# Altium project USB-RIAA.PrjPcb
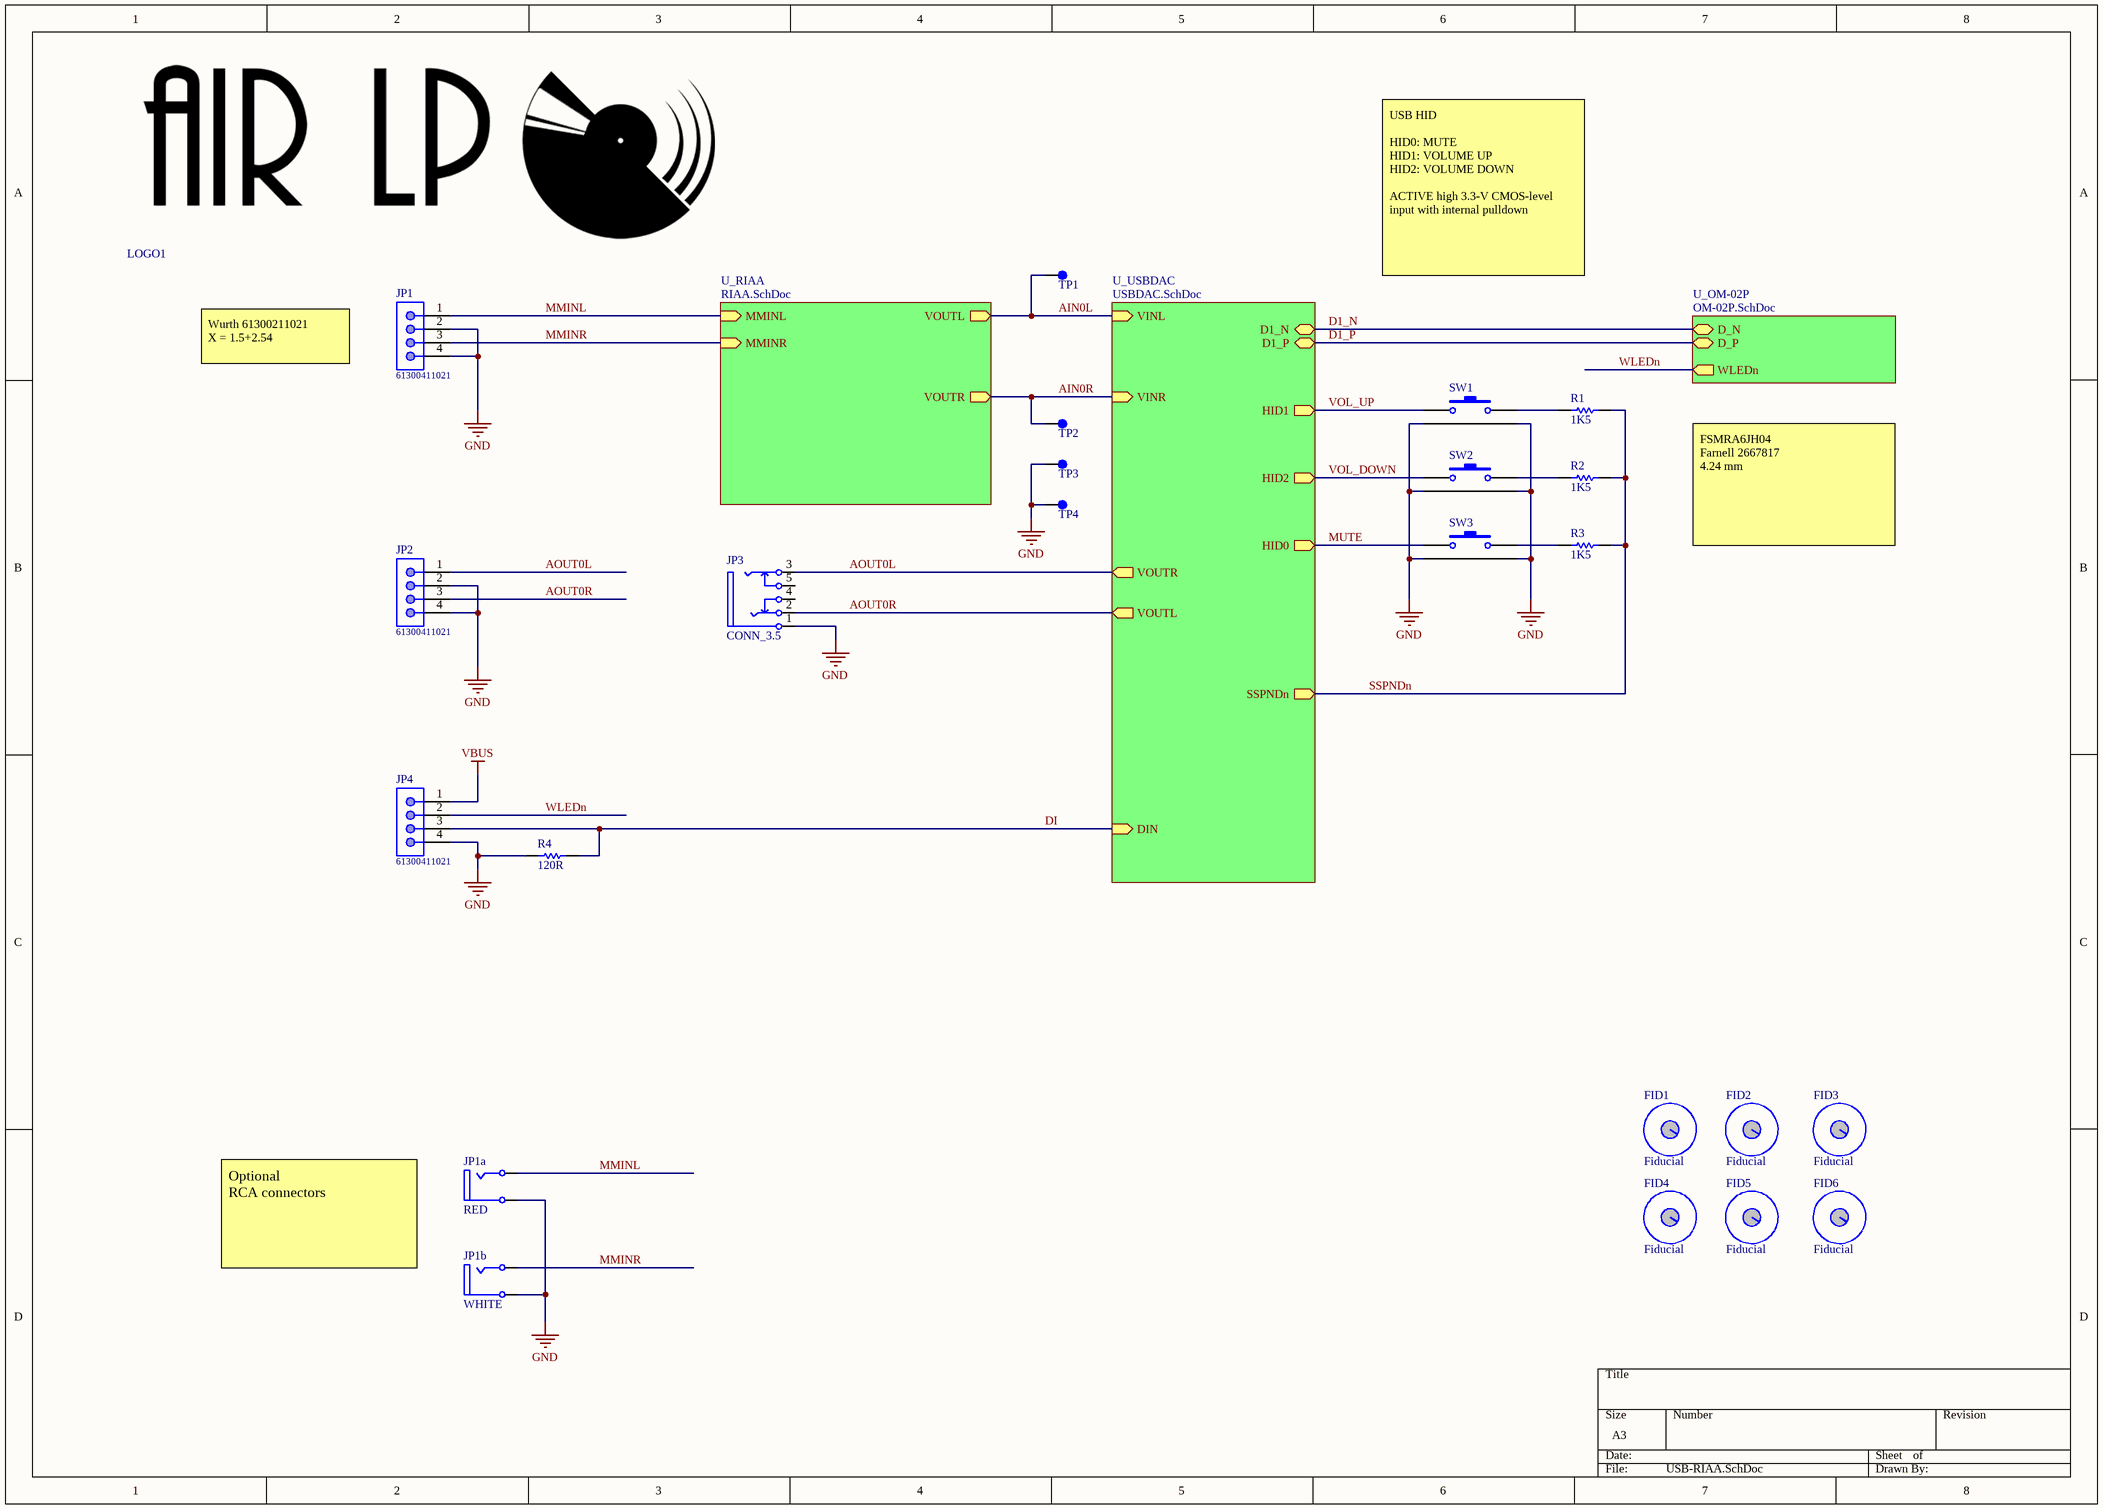
[diagram p0: USB-RIAA.SchDoc]
5 sheets, 135 parts. Net scope: hierarchical (ports join the sheet entries above them; power ports are global).
Board file: USB-RIAA.PcbDoc
Sheets:
  USB-RIAA.SchDoc
    U_RIAA = RIAA.SchDoc
    U_USBDAC = USBDAC.SchDoc
    U_OM-02P = OM-02P.SchDoc
  OM-O2P-ETH.SchDoc

## Sheet USB-RIAA.SchDoc
size A3

### Parts
FID1  Fiducial  [MECH_FID_PLUS]  (no BOM)
FID2  Fiducial  [MECH_FID_PLUS]  (no BOM)
FID3  Fiducial  [MECH_FID_PLUS]  (no BOM)
FID4  Fiducial  [MECH_FID_PLUS]  (no BOM)
FID5  Fiducial  [MECH_FID_PLUS]  (no BOM)
FID6  Fiducial  [MECH_FID_PLUS]  (no BOM)
JP1  61300411021  [61300411021]
JP1a  value RED  [CONN_RCA-Lumberg-Red-No3D]  (hidden comment: RCA RED)
JP1b  value WHITE  [CONN_RCA-Lumberg-White-No3D]  (hidden comment: RCA WHITE)
JP2  61300411021  [61300411021]
JP3  CONN_3.5  [CONN-3.5_LUMBERG_1503_09]
JP4  61300411021  [61300411021]
LOGO1  LOGO-AIRLP  [LOGO-AIR-LP]  (value not drawn)
R1  value 1K5  [RESC0805(2012)_N]  (hidden comment: RES)
R2  value 1K5  [RESC0805(2012)_N]  (hidden comment: RES)
R3  value 1K5  [RESC0805(2012)_N]  (hidden comment: RES)
R4  value 120R  [RESC0805(2012)_N]  (hidden comment: 120R 5% 0805(2012))
SW1  SW_TACT_FSMRA2JH  [SW_FSMRA2JH]  (value not drawn)
SW2  SW_TACT_FSMRA2JH  [SW_FSMRA2JH]  (value not drawn)
SW3  SW_TACT_FSMRA2JH  [SW_FSMRA2JH]  (value not drawn)
TP1  MECH_Testpoint  [MECH_TP_39_mil]  (value not drawn)
TP2  MECH_Testpoint  [MECH_TP_39_mil]  (value not drawn)
TP3  MECH_Testpoint  [MECH_TP_39_mil]  (value not drawn)
TP4  MECH_Testpoint  [MECH_TP_39_mil]  (value not drawn)

### Sub-sheets
U_OM-02P = OM-02P.SchDoc: D_P (bidir), D_N (bidir), WLEDn (out)
U_RIAA = RIAA.SchDoc: MMINL (in), MMINR (in), VOUTL (out), VOUTR (out)
U_USBDAC = USBDAC.SchDoc: VINL (in), VINR (in), VOUTL (out), VOUTR (out), SSPNDn (out), D1_P (bidir), D1_N (bidir), HID0 (out), HID1 (out), HID2 (out), DIN (in)

### Nets
GND: JP1.2 JP1.4 JP1a.1(Ground) JP1b.1(Ground) JP2.2 JP2.4 JP3.1(S) JP4.4 R4.1 SW1.3 SW1.4 SW2.3 SW2.4 SW3.3 SW3.4 TP3.1(Pin1) TP4.1(Pin1)
VBUS: JP4.1
AIN0L: TP1.1(Pin1) ; sheet U_RIAA/VOUTL, sheet U_USBDAC/VINL
AIN0R: TP2.1(Pin1) ; sheet U_RIAA/VOUTR, sheet U_USBDAC/VINR
AOUT0L: JP2.1 JP3.3(RN) ; sheet U_USBDAC/VOUTR
AOUT0R: JP2.3 JP3.2(T) ; sheet U_USBDAC/VOUTL
D1_N: sheet U_USBDAC/D1_N, sheet U_OM-02P/D_N
D1_P: sheet U_USBDAC/D1_P, sheet U_OM-02P/D_P
DI: JP4.3 R4.2 ; sheet U_USBDAC/DIN
MMINL: JP1.1 JP1a.4(Signal) ; sheet U_RIAA/MMINL
MMINR: JP1.3 JP1b.4(Signal) ; sheet U_RIAA/MMINR
MUTE: SW3.1 ; sheet U_USBDAC/HID0
SSPNDn: R1.1 R2.1 R3.1 ; sheet U_USBDAC/SSPNDn
VOL_DOWN: SW2.1 ; sheet U_USBDAC/HID2
VOL_UP: SW1.1 ; sheet U_USBDAC/HID1
WLEDn: JP4.2 ; sheet U_OM-02P/WLEDn
NetR1_2: R1.2 SW1.2
NetR2_2: R2.2 SW2.2
NetR3_2: R3.2 SW3.2

Not connected (* = marked no-connect by the designer): JP3 4 5

### Notes on the sheet
- USB HID
  HID0:	MUTE
  HID1:	VOLUME UP
  HID2:	VOLUME DOWN
  ACTIVE high 3.3-V CMOS-level input with internal pulldown
- Wurth 61300211021
  X = 1.5+2.54
- FSMRA6JH04
  Farnell 2667817
  4.24 mm
- Optional
  RCA connectors

### Library data of the parts
FID1-FID6 = MECH_FIDUCIAL_PLUS
JP1 JP2 JP4 = 61300411021: THT Angled Pin Header WR-PHD, Pitch 2.54 mm, Single Row, 4 pins; Pin Number: 4; Pitch: 2.54 mm; Gender: Male; Rated Current: 3 A; Working Voltage: 250 VAC; Withstanding Voltage: 500 VAC; Contact Resistance: 20 mOhm; ComponentLink1Description: Manufacturer; ComponentLink1URL: http://www.we-online.de; ComponentLink2Description: Datasheet; ComponentLink2URL: https://katalog.we-online.de/em/datasheet/6130xx11021.pdf; Part Number: 61300411021; Published Date: August 2018; Publisher: Wurth Elektronik; Operating Temperature: -40 to 105 degC; Mounting Technology: THT; Packaging: Bag; Row Number: Single; Orientation: Angled
JP1a = CONN_RCA_LUMBERG_RED: RCA panel-mount socket red, 1553 02 rot, Lumberg Connect GmbH; ELFA: 300-68-374; MPN: 1553 02 rot
JP1b = CONN_RCA_LUMBERG_WHITE: RCA panel-mount socket white, 1553 02 weiss, Lumberg Connect GmbH; ELFA: 300-68-376; MPN: 1553 02 weiss; Farnell: 2472276
JP3 = CONN_3.5_1503_09: Jack Socket, 3.5mm, Thru-Hole, Horizontal, 3-Conductor with Tip open & Ring closed; MPN: 1503 09; ELFA: 300-68-357; Farnell: 1243244
LOGO1 = LOGO-AIRLP: LOGO AIR LP
R1-R3 = RES: Generic resistor
R4 = CMP-1013-00052-1: 120R 0.125W 5% 0805 (2012 Metric)  SMD; Case-Metric: 2012; Case-EIA: 0805; Tolerance: 5 %; Technology: SMT; Power: 0.125 W
SW1-SW3 = SW_TACT_FSMRA2JH: SWITCH TACTILE SPST-NO 0.05A 12V; ELFA: 35-665-57; DigiKey: 450-1662-ND; Farnell: 1555987; MPN: FSMRA2JH
TP1-TP4 = MECH_Testpoint: Testpoint

## Sheet RIAA.SchDoc
size A3
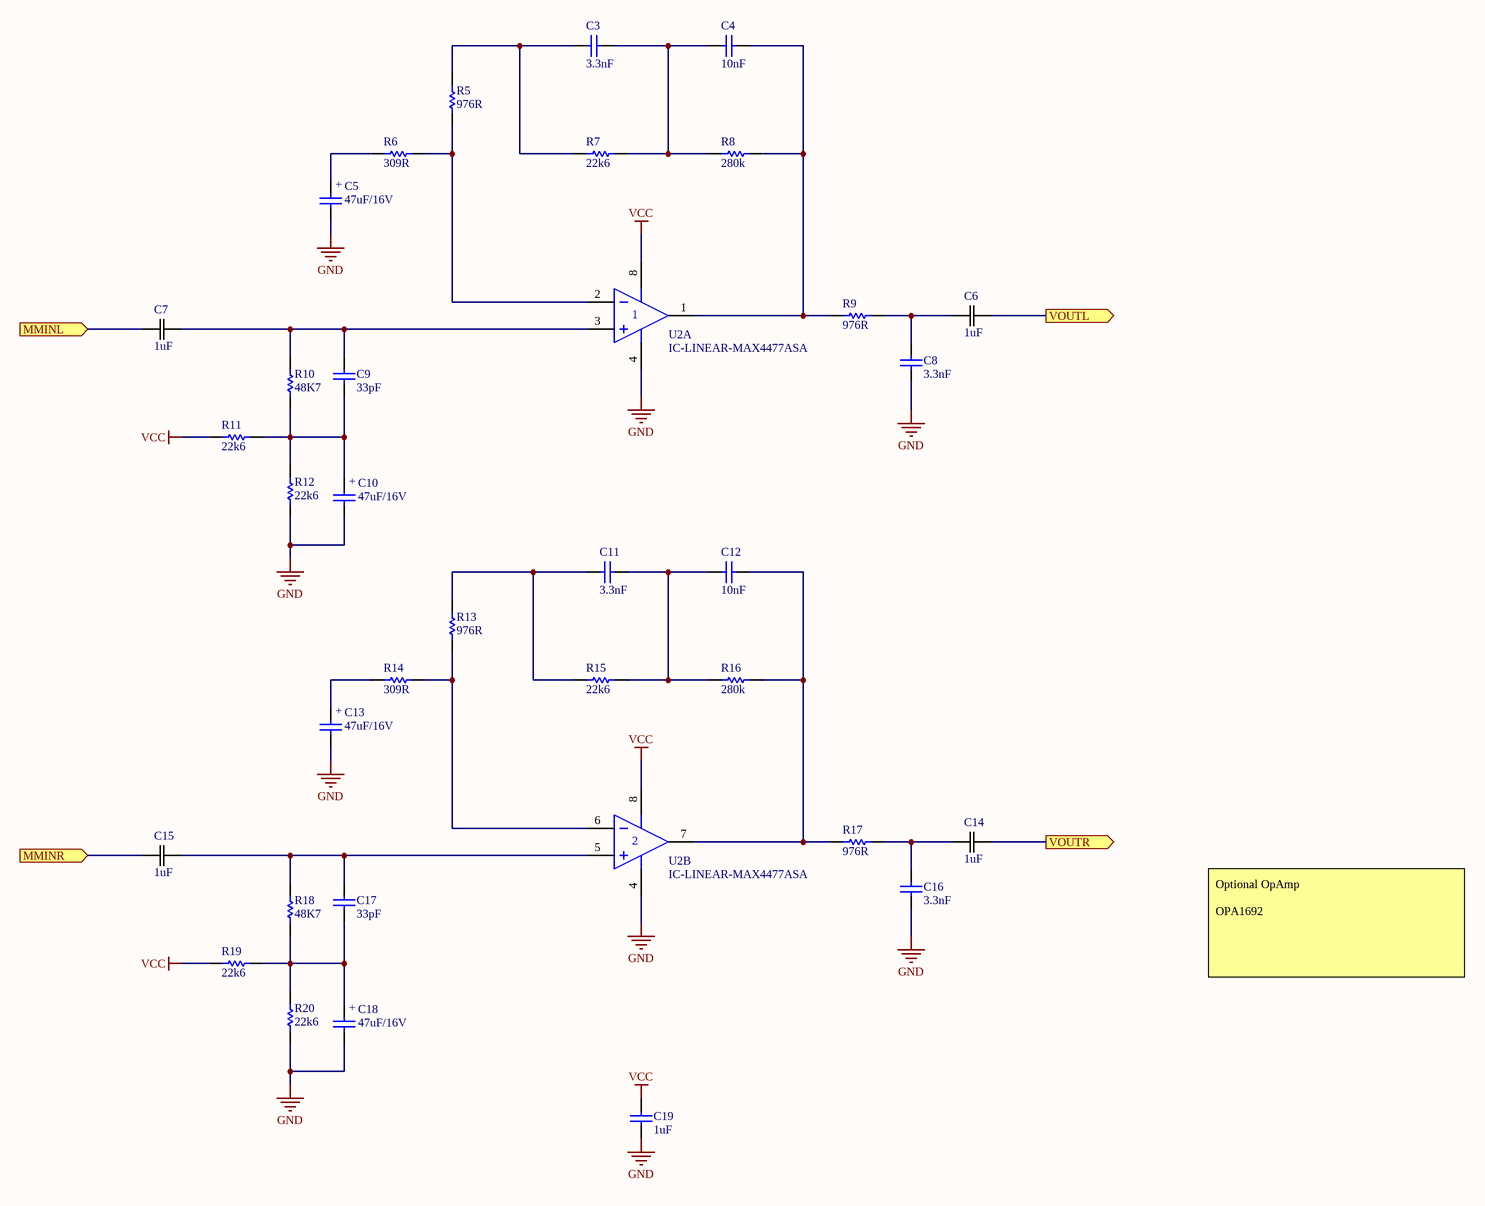
[diagram p1: RIAA.SchDoc]

### Parts
C3  value 3.3nF  [CAPC0805(2012)100_N]  (hidden comment: CAP 3.3nF 16V 0805(2012))
C4  value 10nF  [CAPC0805(2012)145_N]  (hidden comment: CAP 10nF 16V 0805(2012))
C5  47uF/16V  [CAPP_5x5.4]
C6  1uF  [CAP_ECPU_G2]
C7  1uF  [CAP_ECPU_G2]
C8  value 3.3nF  [CAPC0805(2012)100_N]  (hidden comment: CAP 3.3nF 16V 0805(2012))
C9  value 33pF  [CAPC0805(2012)100_N]  (hidden comment: CAP 33pF 16V 0805(2012))
C10  47uF/16V  [CAPP_5x5.4]
C11  value 3.3nF  [CAPC0805(2012)100_N]  (hidden comment: CAP 3.3nF 16V 0805(2012))
C12  value 10nF  [CAPC0805(2012)145_N]  (hidden comment: CAP 10nF 16V 0805(2012))
C13  47uF/16V  [CAPP_5x5.4]
C14  1uF  [CAP_ECPU_G2]
C15  1uF  [CAP_ECPU_G2]
C16  value 3.3nF  [CAPC0805(2012)100_N]  (hidden comment: CAP 3.3nF 16V 0805(2012))
C17  value 33pF  [CAPC0805(2012)100_N]  (hidden comment: CAP 33pF 16V 0805(2012))
C18  47uF/16V  [CAPP_5x5.4]
C19  value 1uF  [CAPC0805(2012)145_N]  (hidden comment: CAP 1uF 16V 0805(2012))
R5  value 976R  [RESC0805(2012)_N]  (hidden comment: 976R 1% 0805(2012))
R6  value 309R  [RESC0805(2012)_N]  (hidden comment: 309R 1% 0805(2012))
R7  value 22k6  [RESC0805(2012)_N]  (hidden comment: 22K6 1% 0805(2012))
R8  value 280k  [RESC0805(2012)_N]  (hidden comment: 280K 1% 0805(2012))
R9  value 976R  [RESC0805(2012)_N]  (hidden comment: 976R 1% 0805(2012))
R10  value 48K7  [RESC0805(2012)_N]  (hidden comment: 48K7 1% 0805(2012))
R11  value 22k6  [RESC0805(2012)_N]  (hidden comment: 22K6 1% 0805(2012))
R12  value 22k6  [RESC0805(2012)_N]  (hidden comment: 22K6 1% 0805(2012))
R13  value 976R  [RESC0805(2012)_N]  (hidden comment: 976R 1% 0805(2012))
R14  value 309R  [RESC0805(2012)_N]  (hidden comment: 309R 1% 0805(2012))
R15  value 22k6  [RESC0805(2012)_N]  (hidden comment: 22K6 1% 0805(2012))
R16  value 280k  [RESC0805(2012)_N]  (hidden comment: 280K 1% 0805(2012))
R17  value 976R  [RESC0805(2012)_N]  (hidden comment: 976R 1% 0805(2012))
R18  value 48K7  [RESC0805(2012)_N]  (hidden comment: 48K7 1% 0805(2012))
R19  value 22k6  [RESC0805(2012)_N]  (hidden comment: 22K6 1% 0805(2012))
R20  value 22k6  [RESC0805(2012)_N]  (hidden comment: 22K6 1% 0805(2012))
U2  IC-LINEAR-MAX4477ASA  [SOIC8_N]  (parts A,B of 2)

### Ports
MMINL (in), MMINR (in), VOUTL (out), VOUTR (out)

### Nets
GND: C5.2 C8.1 C10.2 C13.2 C16.1 C18.2 C19.1 R12.1 R20.1 U2.4(V-)
VCC: C19.2 R11.1 R19.1 U2.8(V+)
AIN0L: C6.2 ; port VOUTL
AIN0R: C14.2 ; port VOUTR
MMINL: C7.1 ; port MMINL
MMINR: C15.1 ; port MMINR
NetC3_1: C3.1 C4.1 R7.2 R8.1
NetC3_2: C3.2 R5.2 R7.1
NetC4_2: C4.2 R8.2 R9.2 U2.1(OUT1)
NetC5_1: C5.1 R6.1
NetC6_1: C6.1 C8.2 R9.1
NetC7_2: C7.2 C9.2 R10.1 U2.3(IN1+)
NetC9_1: C9.1 C10.1 R10.2 R11.2 R12.2
NetC11_1: C11.1 C12.1 R15.2 R16.1
NetC11_2: C11.2 R13.2 R15.1
NetC12_2: C12.2 R16.2 R17.2 U2.7(OUT2)
NetC13_1: C13.1 R14.1
NetC14_1: C14.1 C16.2 R17.1
NetC15_2: C15.2 C17.2 R18.1 U2.5(IN2+)
NetC17_1: C17.1 C18.1 R18.2 R19.2 R20.2
NetR5_1: R5.1 R6.2 U2.2(IN1-)
NetR13_1: R13.1 R14.2 U2.6(IN2-)

### Notes on the sheet
- Optional OpAmp
  OPA1692
- (in symbol CAPP_47UF16V_EEE-1CA470WR) +

### Library data of the parts
C3 C8 C11 C16 = CMP-1036-03397-1: CAP 3.3nF 16V ±1% 0805 (2012 Metric) Thickness 1mm SMD; Tolerance: Â±1%; Case-EIA: 0805; Case-Metric: 2012; Max Thickness: 1 mm; Rated Voltage: 16 V; Technology: SMT
C4 C12 = CMP-1036-03817-1: CAP 10nF 16V ±5% 0805 (2012 Metric) Thickness 1.45mm SMD; Case-EIA: 0805; Case-Metric: 2012; Tolerance: Â±5%; Technology: SMT; Rated Voltage: 16 V; Max Thickness: 1.45 mm
C5 C10 C13 C18 = CAPP_47UF16V_EEE-1CA470WR: 47µF 16V Aluminum Electrolytic Capacitors Radial, Can - SMD 1000 Hrs @ 85°C; Value: 47uF/16V; Farnell: 2753042; DigiKey: PCE3890TR-ND; MPN: EEE-1CA470WR
C6 C7 C14 C15 = CAP-ECP-U1C105MA5: 1µF Film Capacitor  16V Acrylic, Metallized - Stacked 1210 (3225 Metric); Vendor: Panasonic; Built_By: EMA_UL_Team; Type: DEV; C: Copyright (C) 2015 Accelerated Designs. All rights reserved; MPN: ECP-U1C105MA5; RefDes: RefDes; Value: 1uF
C9 C17 = CMP-1036-01404-1: CAP 33pF 16V ±1% 0805 (2012 Metric) Thickness 1mm SMD; Case-Metric: 2012; Case-EIA: 0805; Tolerance: Â±1%; Max Thickness: 1 mm; Technology: SMT; Rated Voltage: 16 V
C19 = CMP-1036-04748-1: CAP 1uF 16V ±20% 0805 (2012 Metric) Thickness 1.45mm SMD; Tolerance: Â±20%; Case-Metric: 2012; Case-EIA: 0805; Technology: SMT; Rated Voltage: 16 V; Max Thickness: 1.45 mm
R5 R9 R13 R17 = CMP-1013-00509-1: 976R 0.125W 1% 0805 (2012 Metric)  SMD; Case-EIA: 0805; Case-Metric: 2012; Power: 0.125 W; Technology: SMT; Tolerance: 1 %
R6 R14 = CMP-1013-00451-1: 309R 0.125W 1% 0805 (2012 Metric)  SMD; Case-EIA: 0805; Case-Metric: 2012; Technology: SMT; Tolerance: 1 %; Power: 0.125 W
R7 R11 R12 R15 R19 R20 = CMP-1013-00661-1: 22K6 0.125W 1% 0805 (2012 Metric)  SMD; Case-Metric: 2012; Case-EIA: 0805; Tolerance: 1 %; Technology: SMT; Power: 0.125 W
R8 R16 = CMP-1013-00785-1: 280K 0.125W 1% 0805 (2012 Metric)  SMD; Case-EIA: 0805; Case-Metric: 2012; Tolerance: 1 %; Power: 0.125 W; Technology: SMT
R10 R18 = CMP-1013-00701-1: 48K7 0.125W 1% 0805 (2012 Metric)  SMD; Case-Metric: 2012; Case-EIA: 0805; Tolerance: 1 %; Power: 0.125 W; Technology: SMT
U2 = IC-LINEAR-MAX4477ASA: Dual Rail-to-Rail output  Low-Power Operational Amplifier; MPN: MAX4477ASA+; Farnell: 1550527

## Sheet USBDAC.SchDoc
size A3
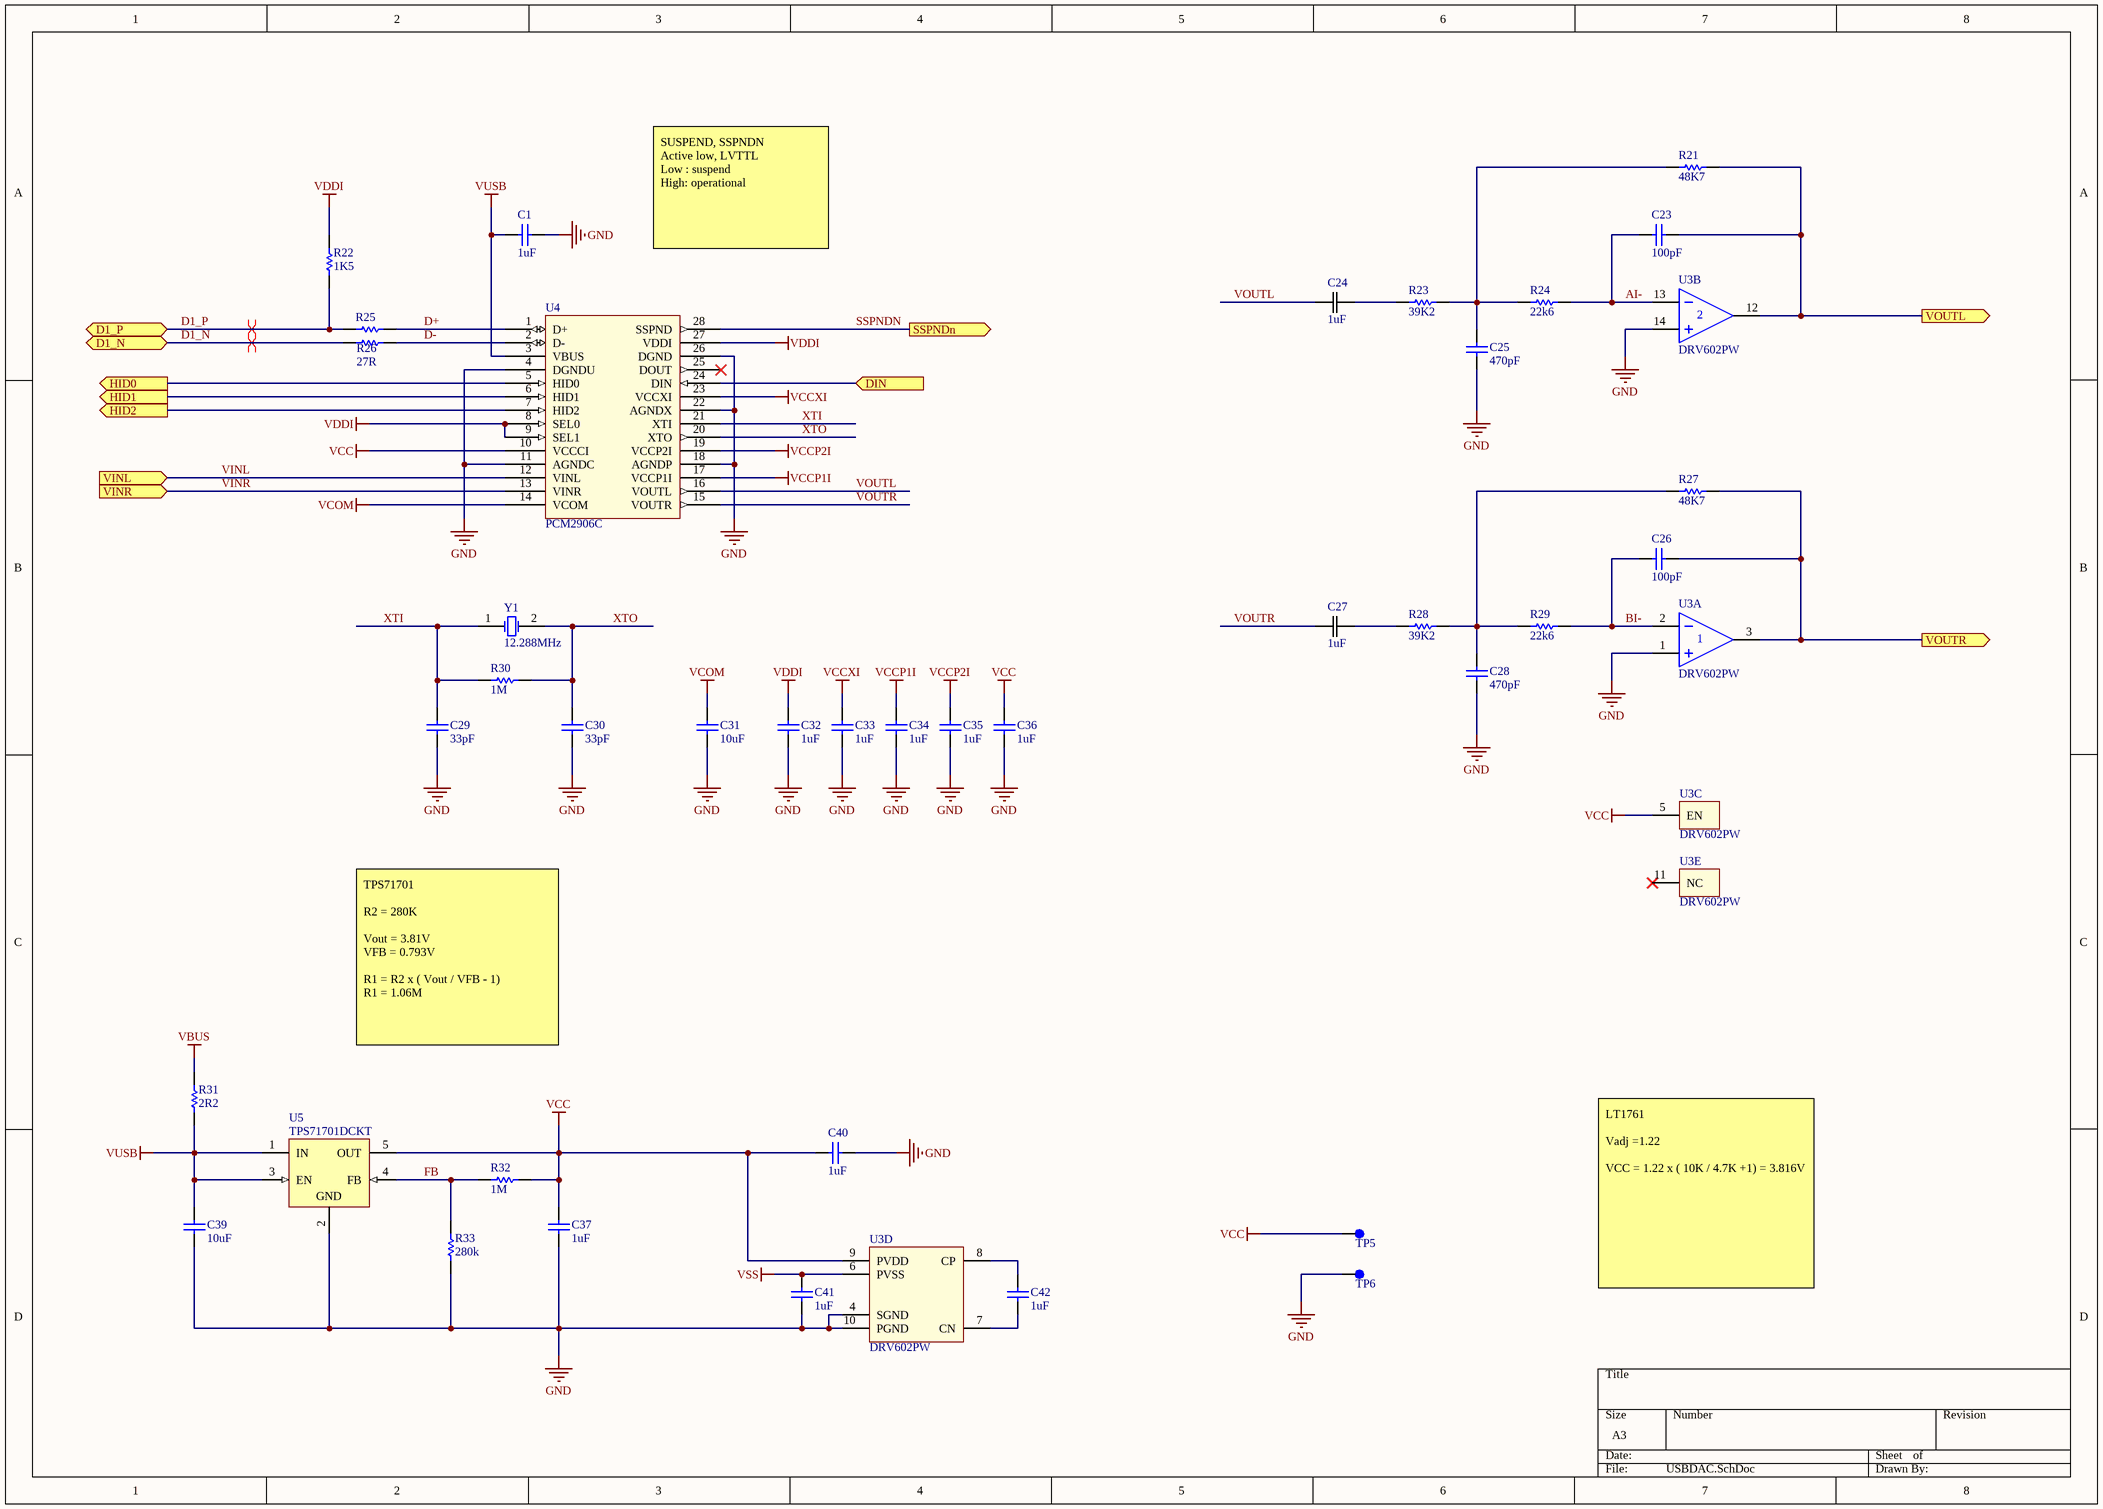
[diagram p2: USBDAC.SchDoc]

### Parts
C1  value 1uF  [CAPC0805(2012)145_N]  (hidden comment: CAP 1uF 16V 0805(2012))
C23  value 100pF  [CAPC0805(2012)75_N]  (hidden comment: CAP)
C24  1uF  [CAP_ECPU_G2]
C25  value 470pF  [CAPC0805(2012)75_N]  (hidden comment: CAP)
C26  value 100pF  [CAPC0805(2012)75_N]  (hidden comment: CAP)
C27  1uF  [CAP_ECPU_G2]
C28  value 470pF  [CAPC0805(2012)75_N]  (hidden comment: CAP)
C29  value 33pF  [CAPC0805(2012)100_N]  (hidden comment: CAP 33pF 16V 0805(2012))
C30  value 33pF  [CAPC0805(2012)100_N]  (hidden comment: CAP 33pF 16V 0805(2012))
C31  value 10uF  [CAPC0805(2012)145_N]  (hidden comment: CAP 10uF 16V 0805(2012))
C32  value 1uF  [CAPC0805(2012)145_N]  (hidden comment: CAP 1uF 16V 0805(2012))
C33  value 1uF  [CAPC0805(2012)145_N]  (hidden comment: CAP 1uF 16V 0805(2012))
C34  value 1uF  [CAPC0805(2012)145_N]  (hidden comment: CAP 1uF 16V 0805(2012))
C35  value 1uF  [CAPC0805(2012)145_N]  (hidden comment: CAP 1uF 16V 0805(2012))
C36  value 1uF  [CAPC0805(2012)145_N]  (hidden comment: CAP 1uF 16V 0805(2012))
C37  value 1uF  [CAPC0805(2012)145_N]  (hidden comment: CAP 1uF 16V 0805(2012))
C39  value 10uF  [CAPC0805(2012)145_N]  (hidden comment: CAP 10uF 16V 0805(2012))
C40  value 1uF  [CAPC0805(2012)145_N]  (hidden comment: CAP 1uF 16V 0805(2012))
C41  value 1uF  [CAPC0805(2012)145_N]  (hidden comment: CAP 1uF 16V 0805(2012))
C42  value 1uF  [CAPC0805(2012)145_L]  (hidden comment: CAP 1uF 16V 0805(2012))
R21  value 48K7  [RESC0805(2012)_N]  (hidden comment: 48K7 1% 0805(2012))
R22  value 1K5  [RESC0805(2012)_N]  (hidden comment: RES)
R23  value 39K2  [RESC0805(2012)_N]  (hidden comment: 39K2 1% 0805(2012))
R24  value 22k6  [RESC0805(2012)_N]  (hidden comment: 22K6 1% 0805(2012))
R25  RES  [RESC0402(1005)_L]  (value not drawn)
R26  value 27R  [RESC0402(1005)_L]  (hidden comment: RES)
R27  value 48K7  [RESC0805(2012)_N]  (hidden comment: 48K7 1% 0805(2012))
R28  value 39K2  [RESC0805(2012)_N]  (hidden comment: 39K2 1% 0805(2012))
R29  value 22k6  [RESC0805(2012)_N]  (hidden comment: 22K6 1% 0805(2012))
R30  value 1M  [RESC0603(1608)_N]  (hidden comment: RES)
R31  value 2R2  [RESC0805(2012)_N]  (hidden comment: 2R2 5% 0805(2012))
R32  value 1M  [RESC0805(2012)_L]  (hidden comment: 1M 1% 0805(2012))
R33  value 280k  [RESC0805(2012)_L]  (hidden comment: 280K 1% 0805(2012))
TP5  MECH_Testpoint  [MECH_TP_39_mil]  (value not drawn)
TP6  MECH_Testpoint  [MECH_TP_39_mil]  (value not drawn)
U3  DRV602PW  [TSSOP14_N]  (parts A,B,C,D,E of 5)
U4  PCM2906C  [SSOP28_N]
U5  TPS71701DCKT  [DCK0005A_L]
Y1  value 12.288MHz  [XTAL_SMD_5.0x3.2]  (hidden comment: ABM3-12.288MHZ-D2Y-T)

### Ports
D1_N (bidir), D1_P (bidir), DIN (in), HID0 (out), HID1 (out), HID2 (out), SSPNDn (out), VINL (in), VINR (in), VOUTL (out), VOUTR (out)

### Nets
GND: C1.1 C25.1 C28.1 C29.1 C30.1 C31.1 C32.1 C33.1 C34.1 C35.1 C36.1 C37.1 C39.1 C40.1 C41.1 R33.1 TP6.1(Pin1) U3.1(IN1+) U3.4(SGND) U3.10(PGND) U3.14(IN2+) U4.4(DGNDU) U4.11(AGNDC) U4.18(AGNDP) U4.22(AGNDX) U4.26(DGND) U5.2(GND)
VBUS: R31.2
VCC: C36.2 C37.2 C40.2 R32.2 TP5.1(Pin1) U3.5(EN) U3.9(PVDD) U4.10(VCCCI) U5.5(OUT)
VCCP1I: C34.2 U4.17(VCCP1I)
VCCP2I: C35.2 U4.19(VCCP2I)
VCCXI: C33.2 U4.23(VCCXI)
VCOM: C31.2 U4.14(VCOM)
VDDI: C32.2 R22.2 U4.8(SEL0) U4.9(SEL1) U4.27(VDDI)
VSS: C41.2 U3.6(PVSS)
VUSB: C1.2 C39.2 R31.1 U4.3(VBUS) U5.1(IN) U5.3(EN)
AI-: C23.2 R24.2 U3.13(IN2-)
AOUT0L: C26.1 R27.1 U3.3(OUT1) ; port VOUTR
AOUT0R: C23.1 R21.1 U3.12(OUT2) ; port VOUTL
BI-: C26.2 R29.2 U3.2(IN1-)
D1_N: R26.1 ; port D1_N
D1_P: R22.1 R25.1 ; port D1_P
D+: R25.2 U4.1(D+)
D-: R26.2 U4.2(D-)
DI: U4.24(DIN) ; port DIN
FB: R32.1 R33.2 U5.4(FB)
MUTE: U4.5(HID0) ; port HID0
SSPNDn: U4.28(SSPND) ; port SSPNDn
VINL: U4.12(VINL) ; port VINL  [project net AIN0L]
VINR: U4.13(VINR) ; port VINR  [project net AIN0R]
VOL_DOWN: U4.7(HID2) ; port HID2
VOL_UP: U4.6(HID1) ; port HID1
VOUTL: C24.1 U4.16(VOUTL)
VOUTR: C27.1 U4.15(VOUTR)
XTI: C29.2 R30.1 U4.21(XTI) Y1.1(OSC1)
XTO: C30.2 R30.2 U4.20(XTO) Y1.2(OSC2)
NetC24_2: C24.2 R23.2
NetC25_2: C25.2 R21.2 R23.1 R24.1
NetC27_2: C27.2 R28.2
NetC28_2: C28.2 R27.2 R28.1 R29.1
NetC42_1: C42.1 U3.7(CN)
NetC42_2: C42.2 U3.8(CP)

Not connected (* = marked no-connect by the designer): U3 11(NC)*; U4 25(DOUT)*

### Layout directives
differential pair: D1_N, D1_P

### Notes on the sheet
- SUSPEND, SSPNDN
  Active low, LVTTL
  Low : suspend
  High: operational
- TPS71701
  R2 = 280K
  Vout = 3.81V
  VFB = 0.793V
  R1 = R2 x ( Vout / VFB - 1)
  R1 = 1.06M
- LT1761
  Vadj =1.22
  VCC = 1.22 x ( 10K / 4.7K +1) = 3.816V

### Library data of the parts
C1 C32-C37 C40-C42 = CMP-1036-04748-1: as C19 on sheet RIAA; Technology: SMT; Rated Voltage: 16 V; Max Thickness: 1.45 mm
C23 C25 C26 C28 = CAP: Generic capacitor non polarised
C24 C27 = CAP-ECP-U1C105MA5: as C6 on sheet RIAA; MPN: ECP-U1C105MA5; RefDes: RefDes; Value: 1uF
C29 C30 = CMP-1036-01404-1: as C9 on sheet RIAA; Max Thickness: 1 mm; Technology: SMT; Rated Voltage: 16 V
C31 C39 = CMP-1036-04929-1: CAP 10uF 16V ±20% 0805 (2012 Metric) Thickness 1.45mm SMD; Tolerance: Â±20%; Case-EIA: 0805; Case-Metric: 2012; Rated Voltage: 16 V; Technology: SMT; Max Thickness: 1.45 mm
R21 R27 = CMP-1013-00701-1: as R10 on sheet RIAA; Tolerance: 1 %; Power: 0.125 W; Technology: SMT
R22 R26 R30 = RES: Generic resistor
R23 R28 = CMP-1013-00690-1: 39K2 0.125W 1% 0805 (2012 Metric)  SMD; Case-Metric: 2012; Case-EIA: 0805; Power: 0.125 W; Tolerance: 1 %; Technology: SMT
R24 R29 = CMP-1013-00661-1: as R7 on sheet RIAA; Tolerance: 1 %; Technology: SMT; Power: 0.125 W
R25 = RES: Generic resistor; Value: 27R
R31 = CMP-1013-00010-1: 2R2 0.125W 5% 0805 (2012 Metric)  SMD; Case-Metric: 2012; Case-EIA: 0805; Technology: SMT; Tolerance: 5 %; Power: 0.125 W
R32 = CMP-1013-00849-1: 1M 0.125W 1% 0805 (2012 Metric)  SMD; Case-Metric: 2012; Case-EIA: 0805; Technology: SMT; Power: 0.125 W; Tolerance: 1 %
R33 = CMP-1013-00785-1: as R8 on sheet RIAA; Tolerance: 1 %; Power: 0.125 W; Technology: SMT
TP5 TP6 = MECH_Testpoint: Testpoint
U3 = IC-LINEAR-DRV602PW: Amplifier IC 2-Channel (Stereo) Class AB 14-TSSOP; Farnell: 1710798; MPN: DRV602PW; DigiKey: 296-24081-1-ND
U4 = IC-AUDIO-PCM2906C: IC STEREO AUD CODEC W/USB 28SSOP
U5 = CMP-0394-00856-2: Single Output LDO, 150 mA, Adjustable 0.9 to 6.2 V Output, 2.5 to 6.5 V Input, with High-Bandwidth PSRR, 5-pin SC70 (DCK), -40 to 125 degC, Green (RoHS & no Sb/Br); Manufacturer: Texas Instruments; Vin(Max)(V): 6.5; Iq(Typ)(mA): 0.05; Vdo(Typ)(mV): 170; Vout Adj(Min)(V): 0.9; Accuracy(%): 3; Iout(Max)(A): 0.15; Vout Adj(Max)(V): 6.2; Vin(Min)(V): 2.5; SubFamily: Single Channel LDO; PackageVersion: 4093553-3/G; Code_JEDEC: MO-203; ComponentLink2Description: Datasheet; ComponentLink1URL: http://www.ti.com/; ComponentLink3Description: Package Specification; ComponentLink2URL: http://www.ti.com/general/docs/lit/getliterature.tsp?genericPartNumber=TPS71701&fileType=pdf; PartNumber: TPS71701DCKT; Eco-Plan: Green (RoHS & no Sb/Br); Mounting Technology: Surface Mount; ComponentLink1Description: Manufacturer URL; ComponentLink3URL: http://www.ti.com/litv/pdf/mpds025f; PackageDescription: 5-Pin Plastic Small-Outline, Body 2 x 1.25 mm, Pitch 0.65 mm; PackageReference: DCK0005A; DatasheetVersion: SBVS068G
Y1 = XTAL_12.288MHz_ABM3-12.288MHZ-D2Y-T: CRYSTAL 12.288MHZ 18PF SMD; Farnell: 1368769; MPN: ABM3-12.288MHZ-D2Y-T; DigiKey: 535-10635-1-ND

## Sheet OM-02P.SchDoc
size A3
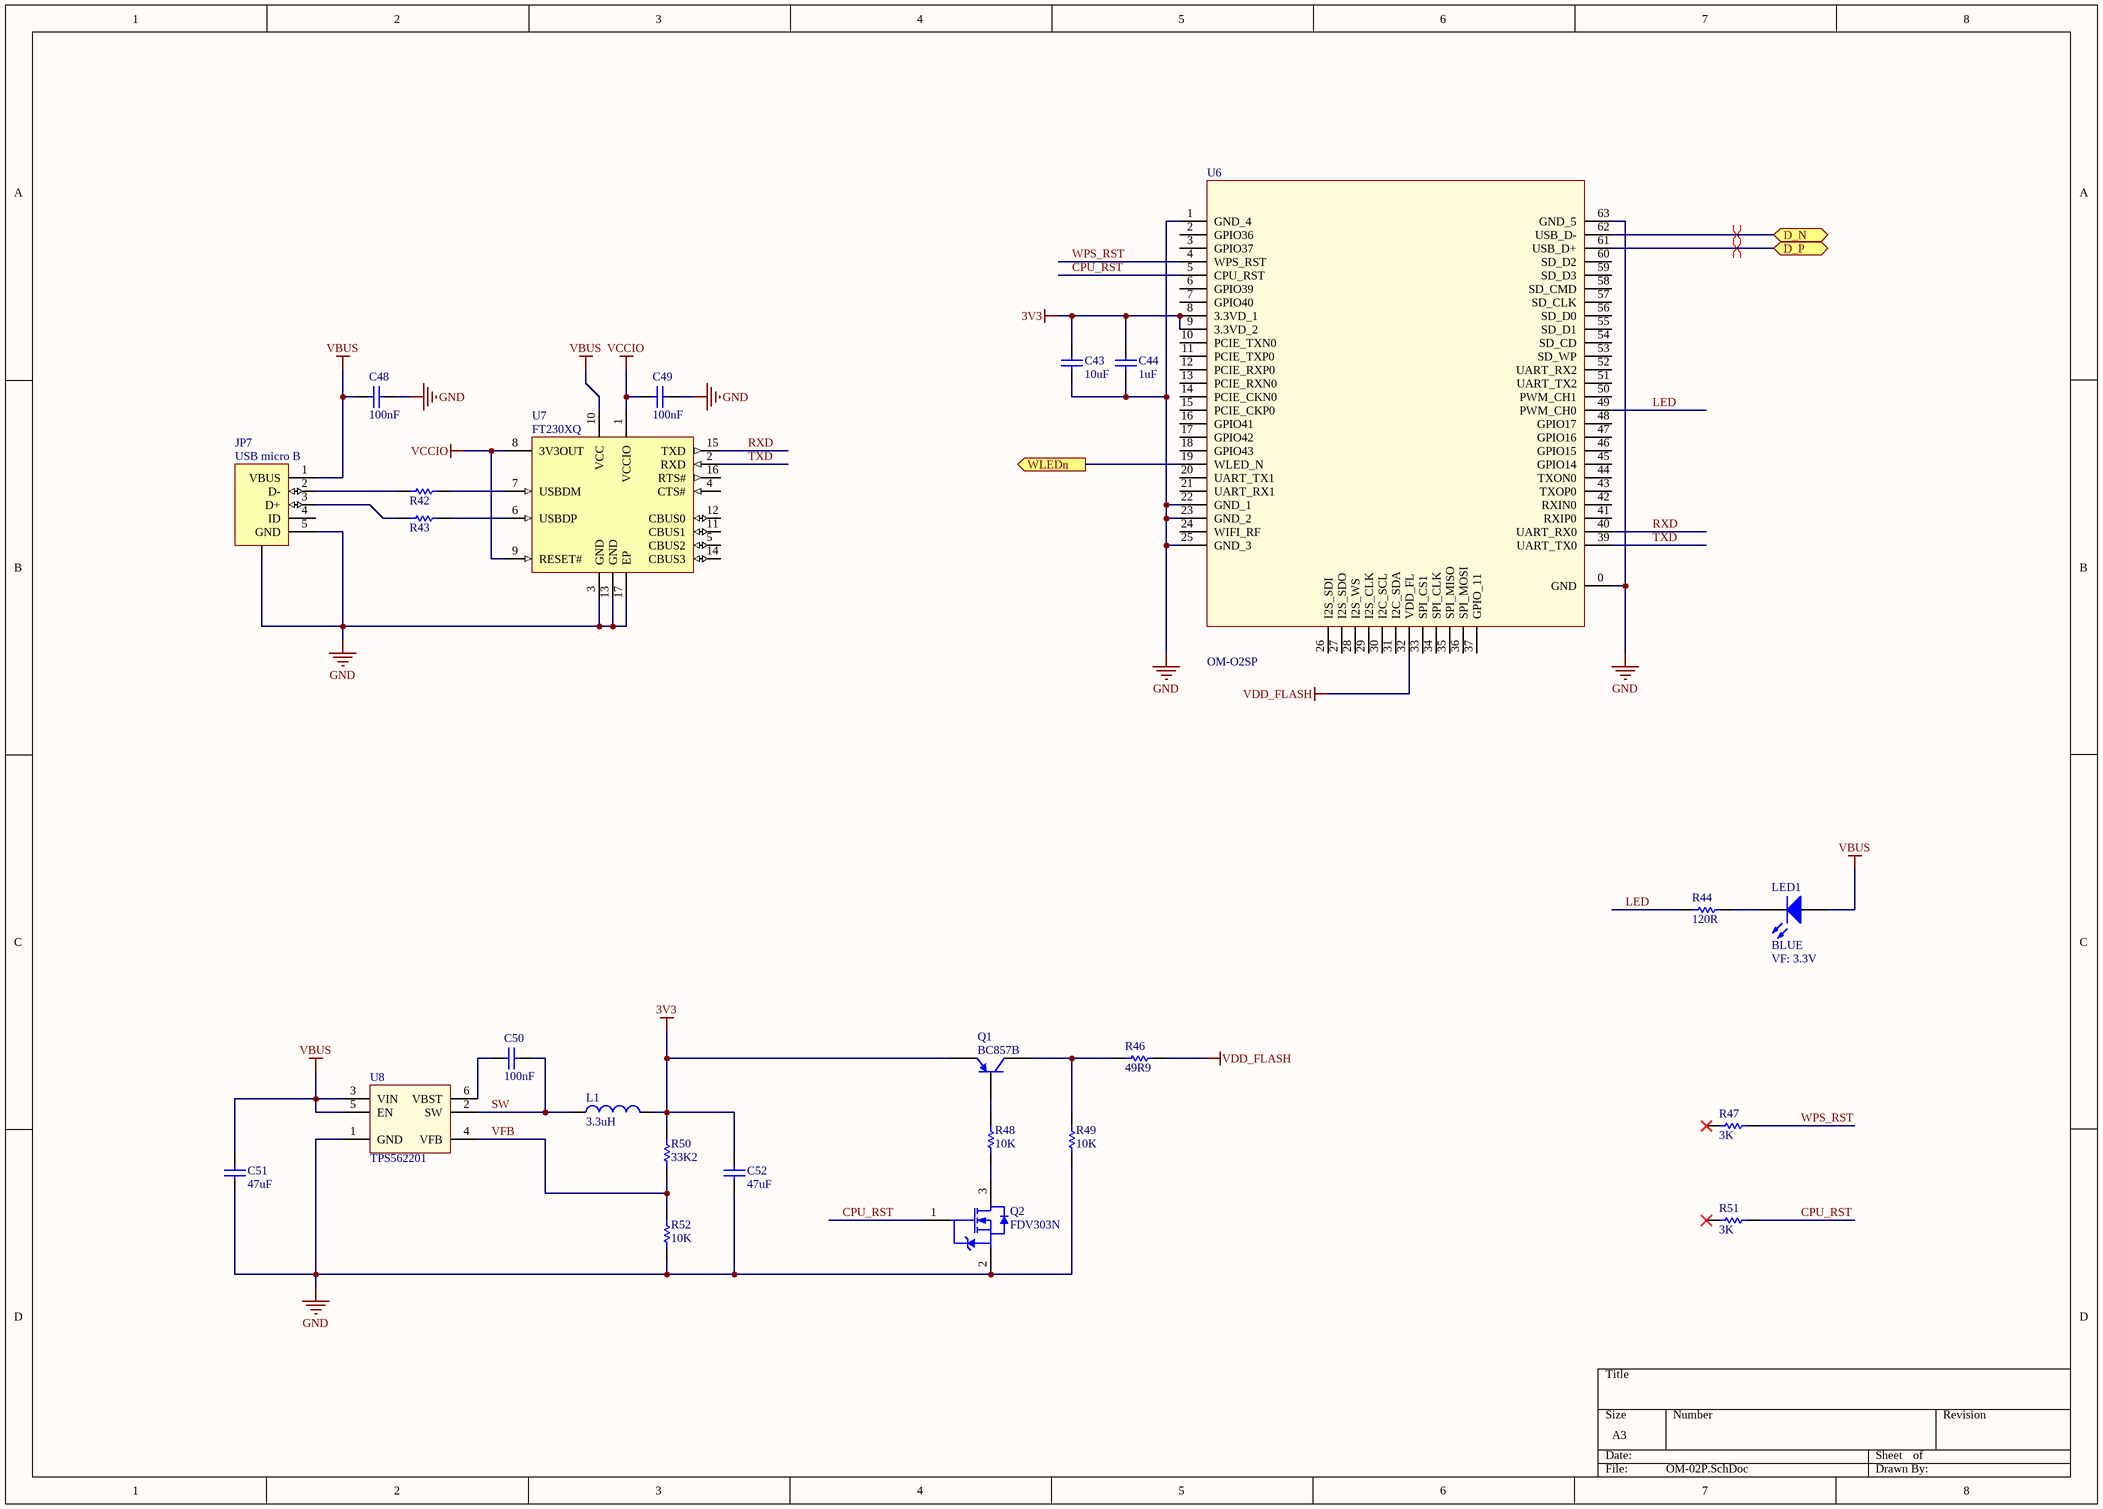
[diagram p3: OM-02P.SchDoc]

### Parts
C43  value 10uF  [CAPC0805(2012)145_N]  (hidden comment: CAP 10uF 16V 0805(2012))
C44  value 1uF  [CAPC0805(2012)145_N]  (hidden comment: CAP 1uF 16V 0805(2012))
C48  value 100nF  [CAPC0805(2012)100_M]  (hidden comment: CAP 100nF 16V 0805(2012))
C49  value 100nF  [CAPC0805(2012)100_M]  (hidden comment: CAP 100nF 16V 0805(2012))
C50  value 100nF  [CAPC0805(2012)100_N]  (hidden comment: CAP 100nF 16V 0805(2012))
C51  value 47uF  [CAPC1210(3225)280_N]  (hidden comment: CAP 47uF 16V 1210(3225))
C52  value 47uF  [CAPC1210(3225)280_N]  (hidden comment: CAP 47uF 16V 1210(3225))
JP7  USB micro B  [CONN_USB_MICRO_B_105017]
L1  value 3.3uH  [CAPC1008(2520)]  (hidden comment: MAMK2520T3R3M)
LED1  BLUE  VF: 3.3V  [LED-KA-4040QBS-D]
Q1  BC857B  [INF-SOT23_M]
Q2  FDV303N  [FAIR-FDV303N-3_V]
R42  RES  [RESC0402(1005)_L]  (value not drawn)
R43  RES  [RESC0402(1005)_L]  (value not drawn)
R44  value 120R  [RESC0805(2012)_N]  (hidden comment: 120R 5% 0805(2012))
R46  value 49R9  [RESC0805(2012)_N]  (hidden comment: 49R9 1% 0805(2012))
R47  value 3K  [RESC0805(2012)_M]  (hidden comment: 3K 5% 0805(2012))
R48  value 10K  [RESC0805(2012)_N]  (hidden comment: 10K 5% 0805(2012))
R49  value 10K  [RESC0805(2012)_N]  (hidden comment: 10K 5% 0805(2012))
R50  value 33K2  [RESC0805(2012)_N]  (hidden comment: 33K2 1% 0805(2012))
R51  value 3K  [RESC0805(2012)_M]  (hidden comment: 3K 5% 0805(2012))
R52  value 10K  [RESC0805(2012)_N]  (hidden comment: 10K 1% 0805(2012))
U6  OM-O2SP  [CPU-OM-O2S]
U7  FT230XQ  [QFN-16_N]
U8  TPS562201  [SOT23-6_L]

### Ports
D_N (bidir), D_P (bidir), WLEDn (out)

### Nets
3V3: C43.2 C44.2 C52.2 L1.2 Q1.2(E) R50.2 U6.8(3.3VD_1) U6.9(3.3VD_2)
GND: C43.1 C44.1 C48.1 C49.1 C51.1 C52.1 JP7.0(CHS) JP7.5(GND) Q2.2(S) R49.2 R52.1 U6.0(GND) U6.1(GND_4) U6.22(GND_1) U6.23(GND_2) U6.25(GND_3) U6.63(GND_5) U7.3(GND) U7.13(GND) U7.17(EP) U8.1(GND)
VBUS: C48.2 C51.2 JP7.1(VBUS) LED1.A U7.10(VCC) U8.3(VIN) U8.5(EN)
VCCIO: C49.2 U7.1(VCCIO) U7.8(3V3OUT) U7.9(RESET#)
VDD_FLASH: R46.2 U6.32(VDD_FL)
CPU_RST: Q2.1(G) R51.1 U6.5(CPU_RST)
D1_N: U6.62(USB_D-) ; port D_N
D1_P: U6.61(USB_D+) ; port D_P
LED: R44.2 U6.49(PWM_CH0)
RXD: U6.40(UART_RX0) U7.15(TXD)
SW: C50.1 L1.1 U8.2(SW)
TXD: U6.39(UART_TX0) U7.2(RXD)
VFB: R50.1 R52.2 U8.4(VFB)
WLEDn: U6.19(WLED_N) ; port WLEDn
WPS_RST: R47.1 U6.4(WPS_RST)
NetC50_2: C50.2 U8.6(VBST)
NetJP7_2: JP7.2(D-) R42.1
NetJP7_3: JP7.3(D+) R43.1
NetLED1_K: LED1.K R44.1
NetQ1_1: Q1.1(B) R48.1
NetQ1_3: Q1.3(C) R46.1 R49.1
NetQ2_3: Q2.3(D) R48.2
NetR42_2: R42.2 U7.7(USBDM)
NetR43_2: R43.2 U7.6(USBDP)

Not connected (* = marked no-connect by the designer): JP7 4(ID); R47 2*; R51 2*; U6 2(GPIO36) 3(GPIO37) 6(GPIO39) 7(GPIO40) 10(PCIE_TXN0) 11(PCIE_TXP0) 12(PCIE_RXP0) 13(PCIE_RXN0) 14(PCIE_CKN0) 15(PCIE_CKP0) 16(GPIO41) 17(GPIO42) 18(GPIO43) 20(UART_TX1) 21(UART_RX1) 24(WIFI_RF) 26(I2S_SDI) 27(I2S_SDO) 28(I2S_WS) 29(I2S_CLK) 30(I2C_SCL) 31(I2C_SDA) 33(SPI_CS1) 34(SPI_CLK) 35(SPI_MISO) 36(SPI_MOSI) 37(GPIO_11) 41(RXIP0) 42(RXIN0) 43(TXOP0) 44(TXON0) 45(GPIO14) 46(GPIO15) 47(GPIO16) 48(GPIO17) 50(PWM_CH1) 51(UART_TX2) 52(UART_RX2) 53(SD_WP) 54(SD_CD) 55(SD_D1) 56(SD_D0) 57(SD_CLK) 58(SD_CMD) 59(SD_D3) 60(SD_D2); U7 4(CTS#) 5(CBUS2) 11(CBUS1) 12(CBUS0) 14(CBUS3) 16(RTS#)

### Layout directives
differential pair: D1_N, D1_P

### Library data of the parts
C43 = CMP-1036-04929-1: as C31 on sheet USBDAC; Rated Voltage: 16 V; Technology: SMT; Max Thickness: 1.45 mm
C44 = CMP-1036-04748-1: as C19 on sheet RIAA; Technology: SMT; Rated Voltage: 16 V; Max Thickness: 1.45 mm
C48-C50 = CMP-1036-04400-1: CAP 100nF 16V ±5% 0805 (2012 Metric) Thickness 1mm SMD; Case-EIA: 0805; Tolerance: Â±5%; Case-Metric: 2012; Max Thickness: 1 mm; Technology: SMT; Rated Voltage: 16 V
C51 C52 = CMP-1038-02296-1: CAP 47uF 16V ±20% 1210 (3225 Metric) Thickness 2.8mm SMD; MPN: C1210C476M4PACTU; Case-EIA: 1210; Case-Metric: 3225; Tolerance: Â±20%; Technology: SMT; Max Thickness: 2.8 mm; Rated Voltage: 16 V
JP7 = CONN_USB_MICRO_B_105017: USB - micro B USB 2.0 Receptacle Connector 5 Position Surface Mount, Right Angle; MPN: 1050170001; Farnell: 2293836; DigiKey: WM1399TR-ND
L1 = L-MAMK2520T3R3M: 3.3µH Shielded Wirewound Inductor 1.7A 156 mOhm Max 1008 (2520 Metric); DigiKey: 587-3227-2-ND; MPN: MAMK2520T3R3M
LED1 = LED-BLUE-KA-4040QBS-D: LED 0805; VALUE: BLUE; MPN: KA-4040QBS-D; Farnell: 2079906
Q1 = CMP-1177-00036-1: PNP Silicon AF Transistor, 45 V VCEO, 100 mA IC, SOT23, Reel, Green; Manufacturer: Infineon; Ptot (max): 330Â mW; fT (typ): 250Â MHz; VCBO (max): 50Â V; ICM (max): 200Â mA; Green: TRUE; VCEO (max): 45Â V; VEBO (max): 5Â V; ICBO (max): 15Â nA; IC (max): 100Â mA; ComponentLink2Description: Datasheet; PartNumber: BC857B; PackageReference: SOT23; ComponentLink1URL: http://www.infineon.com/; IBM (max): 200Â mA; PackageDescription: 3-Pin Small Outline Transistor Package, 1.3 x 2.9 mm Body, 0.95 mm Pitch; ComponentLink3URL: http://www.infineon.com/dgdl/SOT23-Package_Overview.pdf?folderId=db3a30431936bc4b0119532290053c66&fileId=db3a30431936bc4b0119533468123c85; ComponentLink3Description: Package Specification; Mounting Technology: Surface Mount; ComponentLink1Description: Manufacturer URL; PackageVersion: Apr-08; Polarity: PNP; ComponentLink2URL: http://www.infineon.com/dgdl/bc857series_bc858series_bc859series_bc860series.pdf?folderId=db3a304314dca389011541d30fa21656&fileId=db3a304314dca389011541da0e3a1661; Packing: Reel
Q2 = CMP-2000-05111-1: N-Channel MOSFET Transistor, 8 V VGSS, 25 V VDSS, 0.68 A, -55 to 150 degC, 3-Pin SOT23, RoHS, Tape and Reel; Manufacturer: Fairchild; Typical Turn-On Delay Time: 3ns; Channel Mode: Enhancement; RDS-on: 450@4.5VmOhm; Maximum Continuous Drain Current: 0.68A; Maximum Drain Source Voltage: 25V; Rad Hard: No; Typical Fall Time: 13ns; Channel Type: N; Typical Turn-Off Delay Time: 17ns; Maximum Gate Source Voltage: 8V; Typical Rise Time: 8.5ns; Mounting: SurfaceMount; Packaging: Tape&Reel; Manufacturer URL: https://www.fairchildsemi.com/; Datasheet URL: https://datasheet.ciiva.com/22681/1845307-22681736.pdf; Package: 3SOT-23; Category: MOSFET; Operating Temperature: -55to150degC; Datasheet Version: Rev. D2, 07/2014
R42 R43 = RES: Generic resistor; Value: 27R
R44 = CMP-1013-00052-1: as R4 on sheet USB-RIAA; Tolerance: 5 %; Technology: SMT; Power: 0.125 W
R46 = CMP-1013-00363-1: 49R9 0.125W 1% 0805 (2012 Metric)  SMD; Case-Metric: 2012; Case-EIA: 0805; Power: 0.125 W; Tolerance: 1 %; Technology: SMT
R47 R51 = CMP-1013-00085-1: 3K 0.125W 5% 0805 (2012 Metric)  SMD; Case-Metric: 2012; Case-EIA: 0805; Power: 0.125 W; Tolerance: 5 %; Technology: SMT
R48 R49 = CMP-1013-00098-1: 10K 0.125W 5% 0805 (2012 Metric)  SMD; Case-EIA: 0805; Case-Metric: 2012; Power: 0.125 W; Technology: SMT; Tolerance: 5 %
R50 = CMP-1013-00681-1: 33K2 0.125W 1% 0805 (2012 Metric)  SMD; Case-Metric: 2012; Case-EIA: 0805; Technology: SMT; Tolerance: 1 %; Power: 0.125 W
R52 = CMP-1013-00623-1: 10K 0.125W 1% 0805 (2012 Metric)  SMD; Case-Metric: 2012; Case-EIA: 0805; Tolerance: 1 %; Power: 0.125 W; Technology: SMT
U6 = CPU-OM-O2SP: Onion Omega2S
U7 = IC-COM-USB-FT230XQ-SQ17
U8 = IC-PMIC-TPS562201: Buck Switching Regulator IC Positive Adjustable 0.768V 1 Output 2A SOT-23-6 Thin, TSOT-23-6; MPN: TPS562201DDCT

## Sheet OM-O2P-ETH.SchDoc
size A3
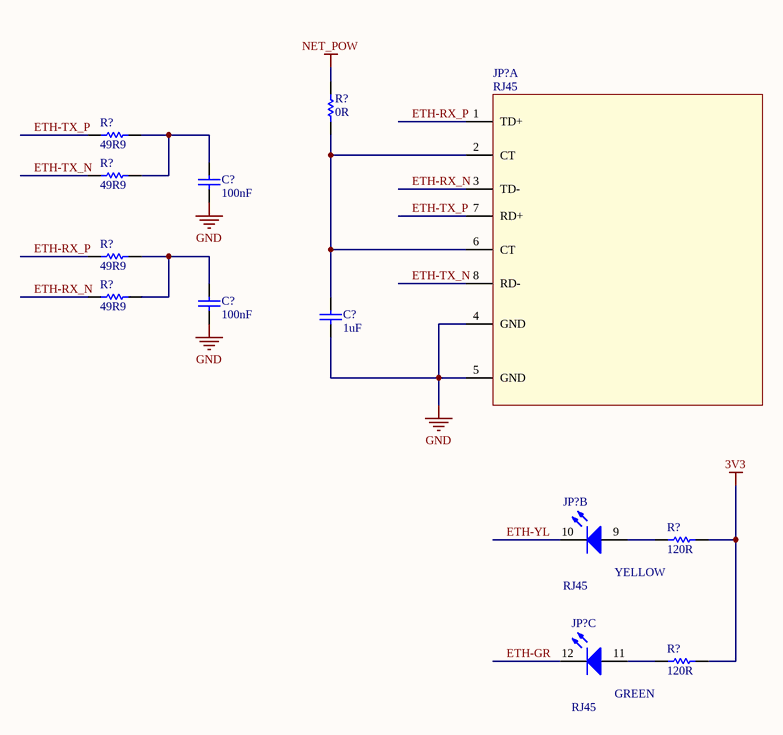
[diagram p4: OM-O2P-ETH.SchDoc]

### Parts
(Parts that share a designator on the sheet are numbered #1, #2 ... from top to bottom, then left to right.)
C?#1  value 100nF  [CAPC0805(2012)100_M]  (hidden comment: CAP 100nF 16V 0805(2012))
C?#2  value 100nF  [CAPC0805(2012)100_M]  (hidden comment: CAP 100nF 16V 0805(2012))
C?#3  value 1uF  [CAPC0805(2012)145_N]  (hidden comment: CAP 1uF 16V 0805(2012))
JP?#1  RJ45  [j0026d21bnl]  (part A of 3)
JP?#2  RJ45  [j0026d21bnl]  (part B of 3)
JP?#3  RJ45  [j0026d21bnl]  (part C of 3)
R?#1  value 0R  [RESC0402(1005)_N]  (hidden comment: Jumper 0402(1005))
R?#2  value 49R9  [RESC0805(2012)_N]  (hidden comment: 49R9 1% 0805(2012))
R?#3  value 49R9  [RESC0805(2012)_N]  (hidden comment: 49R9 1% 0805(2012))
R?#4  value 49R9  [RESC0805(2012)_N]  (hidden comment: 49R9 1% 0805(2012))
R?#5  value 49R9  [RESC0805(2012)_N]  (hidden comment: 49R9 1% 0805(2012))
R?#6  value 120R  [RESC0805(2012)_N]  (hidden comment: 120R 5% 0805(2012))
R?#7  value 120R  [RESC0805(2012)_N]  (hidden comment: 120R 5% 0805(2012))

### Nets
3V3: R?#6.1 R?#7.1
GND: C?#1.1 C?#2.1 C?#3.1 JP?#1.4(GND) JP?#1.5(GND)
NET_POW: R?#1.1
ETH-GR: JP?#3.12(K)
ETH-RX_N: JP?#1.3(TD-) R?#5.1
ETH-RX_P: JP?#1.1(TD+) R?#4.1
ETH-TX_N: JP?#1.8(RD-) R?#3.1
ETH-TX_P: JP?#1.7(RD+) R?#2.1
ETH-YL: JP?#2.10(K)
NetC?#1_2: C?#1.2 R?#2.2 R?#3.2
NetC?#2_2: C?#2.2 R?#4.2 R?#5.2
NetC?#3_2: C?#3.2 JP?#1.2(CT) JP?#1.6(CT) R?#1.2
NetJP?#2_9: JP?#2.9(A) R?#6.2
NetJP?#3_11: JP?#3.11(A) R?#7.2

### Notes on the sheet
- (in symbol CONN_RJ45_J0026D21BNL, part B) YELLOW
- (in symbol CONN_RJ45_J0026D21BNL, part C) GREEN

### Library data of the parts
C?#1 C?#2 = CMP-1036-04400-1: as C48 on sheet OM-02P; Max Thickness: 1 mm; Technology: SMT; Rated Voltage: 16 V
C?#3 = CMP-1036-04748-1: as C19 on sheet RIAA; Technology: SMT; Rated Voltage: 16 V; Max Thickness: 1.45 mm
JP?#1-JP?#3 = CONN_RJ45_J0026D21BNL: 1 Port RJ45 Magjack Connector Panel Mount, Through Hole 10/100 Base-TX
R?#1 = CMP-1011-00001-1: Jumper 0402 (1005 Metric); Tolerance: None; Case-Metric: 1005; Case-EIA: 0402; Power: None; Technology: SMT
R?#2-R?#5 = CMP-1013-00363-1: as R46 on sheet OM-02P; Power: 0.125 W; Tolerance: 1 %; Technology: SMT
R?#6 R?#7 = CMP-1013-00052-1: as R4 on sheet USB-RIAA; Tolerance: 5 %; Technology: SMT; Power: 0.125 W

## Nets that join several sheets
3V3: OM-02P (8 pins), OM-O2P-ETH (R?#6.1 R?#7.1)
GND: USB-RIAA (17 pins), RIAA (10 pins), USBDAC (27 pins), OM-02P (21 pins), OM-O2P-ETH (5 pins)
VBUS: USB-RIAA (JP4.1), USBDAC (R31.2), OM-02P (7 pins)
VCC: RIAA (C19.2 R11.1 R19.1 U2.8), USBDAC (9 pins)
AIN0L: USB-RIAA (TP1.1), RIAA (C6.2), USBDAC (U4.12)
AIN0R: USB-RIAA (TP2.1), RIAA (C14.2), USBDAC (U4.13)
AOUT0L: USB-RIAA (JP2.1 JP3.3), USBDAC (C26.1 R27.1 U3.3)
AOUT0R: USB-RIAA (JP2.3 JP3.2), USBDAC (C23.1 R21.1 U3.12)
D1_N: USBDAC (R26.1), OM-02P (U6.62)
D1_P: USBDAC (R22.1 R25.1), OM-02P (U6.61)
DI: USB-RIAA (JP4.3 R4.2), USBDAC (U4.24)
MMINL: USB-RIAA (JP1.1 JP1a.4), RIAA (C7.1)
MMINR: USB-RIAA (JP1.3 JP1b.4), RIAA (C15.1)
MUTE: USB-RIAA (SW3.1), USBDAC (U4.5)
SSPNDn: USB-RIAA (R1.1 R2.1 R3.1), USBDAC (U4.28)
VOL_DOWN: USB-RIAA (SW2.1), USBDAC (U4.7)
VOL_UP: USB-RIAA (SW1.1), USBDAC (U4.6)
WLEDn: USB-RIAA (JP4.2), OM-02P (U6.19)